# Altium schematic sheet Sch_LVTN.SchDoc
size A
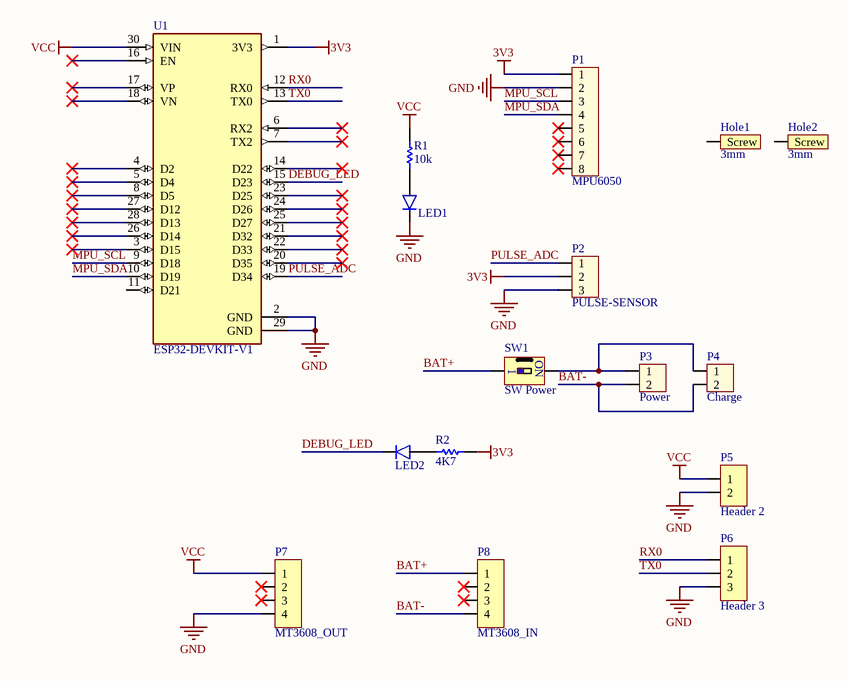
[diagram p0: Sch_LVTN.SchDoc]

## Parts
Hole1  3mm  [SCREW/3M/7M]
Hole2  3mm  [SCREW/3M/7M]
LED1  Led  [Led SMD 0805]  (value not drawn)
LED2  Led  [Led SMD 0805]  (value not drawn)
P1  MPU6050  [CON Header 8]
P2  PULSE-SENSOR  [CON Header 3]
P3  Power  [CON Header 2]
P4  Charge  [CON Header 2 - RA]
P5  Header 2  [Header 2]
P6  Header 3  [Header 3]
P7  MT3608_OUT  [Header 4]
P8  MT3608_IN  [Header 4]
R1  10k  [R 0805 (2012)]
R2  4K7  [R 0805 (2012)]
SW1  SW Power  [SW/DIP1]
U1  ESP32-DEVKIT-V1  [MODULE_ESP32_DEVKIT_V1]

## Nets
3V3: P1.1 P2.2 R2.2 U1.1(3V3)
GND: LED1.2(K) P1.2 P2.3 P5.2 P6.3 P7.4 U1.2(GND) U1.29(GND)
VCC: P5.1 P7.1 R1.2 U1.30(VIN)
BAT+: P8.1 SW1.1
BAT-: P3.2 P4.2 P8.4
DEBUG_LED: LED2.2(K) U1.15(D23)
MPU_SCL: P1.3 U1.9(D18)
MPU_SDA: P1.4 U1.10(D19)
PULSE_ADC: P2.1 U1.19(D34)
RX0: P6.1 U1.12(RX0)
TX0: P6.2 U1.13(TX0)
NetLED1_1: LED1.1(A) R1.1
NetLED2_1: LED2.1(A) R2.1
NetP3_1: P3.1 P4.1 SW1.2

Not connected (* = marked no-connect by the designer): Hole1 1(Screw); Hole2 1(Screw); P1 5* 6* 7* 8*; P7 2* 3*; P8 2* 3*; U1 3(D15)* 4(D2)* 5(D4)* 6(RX2)* 7(TX2)* 8(D5)* 11(D21) 14(D22)* 16(EN)* 17(VP)* 18(VN)* 20(D35)* 21(D32)* 22(D33)* 23(D25)* 24(D26)* 25(D27)* 26(D14)* 27(D12)* 28(D13)*

## Notes on the sheet
- (in symbol SW DIP-1) ON

## Library data of the parts
Hole1 Hole2 = Screw
LED1 LED2 = Led: Typical LED
P1 = Con8: Connector 8; Value: Connector 8
P2 = Con3: Connector 3; Value: Connector 3
P3 P4 = Con2: Connector 2; Value: Connector 2
P5 = Header 2: Header, 2-Pin; LatestRevisionDate: 17-Jul-2002; LatestRevisionNote: Re-released for DXP Platform.; Publisher: Altium Limited
P6 = Header 3: Header, 3-Pin
P7 P8 = Header 4: Header, 4-Pin
R1 R2 = Resistor: Published: 8-Jun-2000; LatestRevisionDate: 17-Jul-2002; LatestRevisionNote: Re-released for DXP Platform.; PackageReference: AXIAL-0.3; Publisher: Altium Limited
SW1 = SW DIP-1
U1 = ESP32-DEVKIT-V1: Dual core, Wi-Fi: 2.4 GHz up to 150 Mbits/s,BLE (Bluetooth Low Energy) and legacy Bluetooth, 32 bits, Up to 240 MHz; MF: Do it; Value: *; MP: ESP32-DEVKIT-V1; SnapEDA_Link: https://www.snapeda.com/parts/ESP32-DEVKIT-V1/Do+it/view-part/?ref=snap; Price: None; Package: None; Check_prices: https://www.snapeda.com/parts/ESP32-DEVKIT-V1/Do+it/view-part/?ref=eda; Availability: Not in stock